# Altium project Flight-Controller.PrjPcb (part 2 of 2)
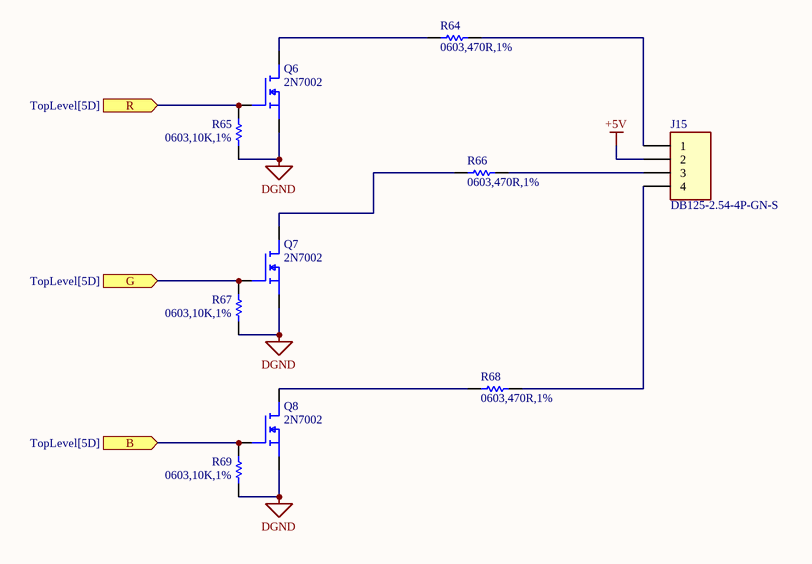
[diagram p15: RGB-LED.SchDoc]

## Nets that join several sheets
+3V3: TopLevel (20 pins), STM32H745 (49 pins), MMC5983MA (5 pins), SD Card (C29.2 J10.4 R16.2), ICM40609 (7 pins), MS5611 (C32.2 IC3.1), MAX M10S (C43.2 C44.2 U1.7 U1.8), USBC (C42.2 IC6.2 IC6.4), BMI088 (8 pins), Debug (IC8.1 J13.3), Ethernet Phy (25 pins), TTL (C60.2 IC11.1), Power (D3.1)
+5V: TopLevel (8 pins), USBC (C41.2 D1.1 IC6.3), TTL (6 pins), Power (8 pins), RGB-LED (J15.2)
DGND: TopLevel (36 pins), STM32H745 (44 pins), MMC5983MA (5 pins), SD Card (6 pins), ICM40609 (6 pins), MS5611 (C32.1 IC3.2 IC3.3), MAX M10S (12 pins), USBC (16 pins), BMI088 (6 pins), Debug (9 pins), Ethernet Phy (24 pins), TTL (7 pins), Power (11 pins), RGB-LED (6 pins)
ADC1_INP9: STM32H745 (IC1.49), Power (D3.2 R60.1 R62.2)
BACKPLANE RX: TopLevel (J1.37), STM32H745 (IC1.76)
BACKPLANE TX: TopLevel (J1.38), STM32H745 (IC1.77)
BMI_ACC_CS: STM32H745 (IC1.2 R11.1), BMI088 (IC2.14)
BMI_ACC_INT1: STM32H745 (IC1.9), BMI088 (IC2.16 R17.1)
BMI_ACC_INT2: STM32H745 (IC1.10), BMI088 (IC2.1 R18.1)
BMI_GYRO_CS: STM32H745 (IC1.3 R12.1), BMI088 (IC2.5)
BMI_GYRO_INT1: STM32H745 (IC1.24), BMI088 (IC2.12 R19.1)
BMI_GYRO_INT2: STM32H745 (IC1.23), BMI088 (IC2.13 R20.1)
BUZZER_PWM: STM32H745 (IC1.97), Power (Q5.1 R63.2)
CRS_DV: STM32H745 (IC1.46), Ethernet Phy (R49.1)
DEBUG_SWCLK: STM32H745 (IC1.107), Debug (IC8.4 J13.6)
DEBUG_SWDIO: STM32H745 (IC1.102), Debug (IC8.6 J13.4)
ESC1 PWM: TopLevel (J1.33 J8.2), STM32H745 (IC1.82)
ESC2 PWM: TopLevel (J1.35 J9.2), STM32H745 (IC1.83)
ETH_MDC: STM32H745 (IC1.29), Ethernet Phy (IC10.31)
ETH_MDIO: STM32H745 (IC1.39), Ethernet Phy (IC10.30 R46.2)
ETH_REF_CLK: STM32H745 (IC1.38), Ethernet Phy (R45.1)
ETH_RXD0: STM32H745 (IC1.47), Ethernet Phy (R41.1)
ETH_RXD1: STM32H745 (IC1.48), Ethernet Phy (R44.1)
EXTRA_PD11: TopLevel (J1.45), STM32H745 (IC1.81)
EXTRA_PE9: TopLevel (J1.69), STM32H745 (IC1.59)
EXTRA_PE10: TopLevel (J1.12), STM32H745 (IC1.60)
EXTRA_PE13: TopLevel (J1.70), STM32H745 (IC1.63)
EXTRA_PG13: TopLevel (J1.30), STM32H745 (IC1.126)
FC ETH RD_N: TopLevel (J1.2), Ethernet Phy (IC10.13 R50.2)
FC ETH RD_P: TopLevel (J1.3), Ethernet Phy (IC10.14 R51.2)
FC ETH TD_N: TopLevel (J1.5), Ethernet Phy (IC10.16 R43.1)
FC ETH TD_P: TopLevel (J1.6), Ethernet Phy (IC10.17 R42.1)
FC FDCAN RX: TopLevel (J1.47), STM32H745 (IC1.136)
FC FDCAN TX: TopLevel (J1.49), STM32H745 (IC1.137)
GNSS RST: STM32H745 (IC1.28), MAX M10S (R27.1)
GNSS RX: TopLevel (J1.52), STM32H745 (IC1.133), MAX M10S (U1.3)
GNSS TX: TopLevel (J1.53), STM32H745 (IC1.132), MAX M10S (U1.2)
I2C4 SCL: TopLevel (J1.62), STM32H745 (IC1.53 R6.2)
I2C4 SDA: TopLevel (J1.63), STM32H745 (IC1.54 R4.2)
ICM_INT1: STM32H745 (IC1.62), ICM40609 (IC4.12 R21.1)
ICM_INT2: STM32H745 (IC1.65), ICM40609 (IC4.19 R22.1)
JETSON RX: TopLevel (J1.95), STM32H745 (IC1.117)
JETSON TX: TopLevel (J1.94), STM32H745 (IC1.120)
LPUART1_RX: STM32H745 (IC1.99), Debug (IC9.6 J13.13)
LPUART1_TX: STM32H745 (IC1.98), Debug (IC9.1 J13.14)
LVL SHIFT OE: STM32H745 (IC1.115), TTL (IC11.8 R55.2)
MAUWB1 RX: TopLevel (J1.91 J3.3), STM32H745 (IC1.74)
MAUWB1 TX: TopLevel (J1.92 J3.4), STM32H745 (IC1.75)
MAUWB2 RX: TopLevel (J1.97 J4.3), STM32H745 (IC1.93)
MAUWB2 TX: TopLevel (J1.98 J4.4), STM32H745 (IC1.94)
MMC_INT: STM32H745 (IC1.86), MMC5983MA (IC5.15 R23.1)
MMWAVE DE: TopLevel (J1.89), STM32H745 (IC1.108)
MMWAVE RX: TopLevel (J1.87 J5.3), STM32H745 (IC1.113)
MMWAVE TX: TopLevel (J1.88 J5.4), STM32H745 (IC1.112)
NetIC12_2: TopLevel (J7.1), TTL (IC12.2 IC12.3 R54.1)
NRST: STM32H745 (C26.2 IC1.27), Debug (B1.1 B1.2 IC9.4 J13.12)
PC15: TopLevel (J1.16), STM32H745 (IC1.11), Power (Q4.2 R61.2)
PHY_INT: STM32H745 (IC1.40), Ethernet Phy (IC10.7 R48.2)
PHY_RST: STM32H745 (IC1.64), Ethernet Phy (IC10.29)
PWM2: TopLevel (J1.15), STM32H745 (IC1.61)
PWM3: TopLevel (J1.68), STM32H745 (IC1.45)
PWM4: TopLevel (J1.11), STM32H745 (IC1.50)
PWM5: TopLevel (J1.9), STM32H745 (IC1.37)
PWM6: TopLevel (J1.72), STM32H745 (IC1.66)
RFD RX: TopLevel (J1.65 J2.3), STM32H745 (IC1.58)
RFD TX: TopLevel (J1.66 J2.4), STM32H745 (IC1.57)
RGB_B: STM32H745 (IC1.84), RGB-LED (Q7.1 R67.2)
RGB_G: STM32H745 (IC1.78), RGB-LED (Q6.1 R65.2)
RGB_R: STM32H745 (IC1.87), RGB-LED (Q8.1 R69.2)
SD_CARD_DETECT: STM32H745 (IC1.116), SD Card (J10.9 R16.1)
SDMMC1_CK: STM32H745 (IC1.111), SD Card (J10.5)
SDMMC1_CMD: STM32H745 (IC1.114), SD Card (J10.3)
SDMMC1_D0: STM32H745 (IC1.95), SD Card (J10.7)
SDMMC1_D1: STM32H745 (IC1.96), SD Card (J10.8)
SDMMC1_D2: STM32H745 (IC1.109), SD Card (J10.1)
SDMMC1_D3: STM32H745 (IC1.110), SD Card (J10.2)
SERVO DE: TopLevel (J1.40), STM32H745 (IC1.85), TTL (IC11.3)
SERVO RX: TopLevel (J1.43), STM32H745 (IC1.139), TTL (IC11.4)
SERVO TX: TopLevel (J1.42), STM32H745 (IC1.138), TTL (IC11.2)
SPI1_MISO: STM32H745 (IC1.122), MMC5983MA (IC5.5)
SPI1_MOSI: STM32H745 (IC1.121), MMC5983MA (IC5.16)
SPI1_NSS: STM32H745 (IC1.123 R15.2), MMC5983MA (IC5.4)
SPI1_SCK: STM32H745 (IC1.124), MMC5983MA (IC5.1)
SPI2_MISO: STM32H745 (IC1.30), MS5611 (IC3.6)
SPI2_MOSI: STM32H745 (IC1.31), MS5611 (IC3.7)
SPI2_NSS: STM32H745 (IC1.100 R14.2), MS5611 (IC3.4 IC3.5)
SPI2_SCK: STM32H745 (IC1.101), MS5611 (IC3.8)
SPI3_MISO: STM32H745 (IC1.131), ICM40609 (IC4.9)
SPI3_MOSI: STM32H745 (IC1.51), ICM40609 (IC4.24)
SPI3_NSS: STM32H745 (IC1.43 R9.2), ICM40609 (IC4.22)
SPI3_SCK: STM32H745 (IC1.130), ICM40609 (IC4.23)
SPI4_MISO: STM32H745 (IC1.4), BMI088 (IC2.10 IC2.15)
SPI4_MOSI: STM32H745 (IC1.5), BMI088 (IC2.9)
SPI4_SCK: STM32H745 (IC1.1), BMI088 (IC2.8)
SPI5 MISO: TopLevel (J1.55), STM32H745 (IC1.22)
SPI5 MOSI: TopLevel (J1.60), STM32H745 (IC1.52)
SPI5 NSS: TopLevel (J1.58), STM32H745 (IC1.20 R10.2)
SPI5 SCK: TopLevel (J1.56), STM32H745 (IC1.21)
SPI6 MISO: TopLevel (J1.28), STM32H745 (IC1.125)
SPI6 MOSI: TopLevel (J1.27), STM32H745 (IC1.127)
SPI6 NSS: TopLevel (J1.25), STM32H745 (IC1.88 R13.2)
SPI6 SCK: TopLevel (J1.24), STM32H745 (IC1.44)
STAT_LEDR: TopLevel (R1.1), STM32H745 (IC1.134)
TXD0: STM32H745 (R5.2), Ethernet Phy (IC10.3)
TXD1: STM32H745 (R7.2), Ethernet Phy (IC10.4)
TXEN: STM32H745 (R8.2), Ethernet Phy (IC10.2)

## Assembly variants
Var 1A: not fitted C47 C48 R32 R36 R37